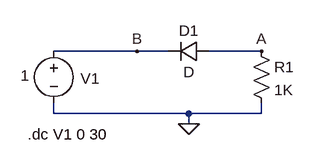
[diagram p0: schematic pn Junction Diode Reverse Biased.asc]
pn Junction Diode Reverse Biased.asc, the LTspice schematic file:
Version 4
SHEET 1 880 680
WIRE 96 96 -32 96
WIRE 144 96 96 96
WIRE 288 96 208 96
WIRE -32 192 -32 176
WIRE 176 192 -32 192
WIRE 288 192 288 176
WIRE 288 192 176 192
WIRE 176 208 176 192
FLAG 176 208 0
FLAG 288 96 A
FLAG 96 96 B
SYMBOL res 272 80 R0
SYMATTR InstName R1
SYMATTR Value 1K
SYMBOL voltage -32 80 R0
WINDOW 123 0 0 Left 0
WINDOW 39 0 0 Left 0
WINDOW 0 41 58 Left 2
WINDOW 3 -51 53 Left 2
SYMATTR InstName V1
SYMATTR Value 1
SYMBOL diode 208 80 R90
WINDOW 0 0 32 VBottom 2
WINDOW 3 32 32 VTop 2
SYMATTR InstName D1
TEXT -72 224 Left 2 !.dc V1 0 30

The netlist it stands for:
* pn Junction Diode Reverse Biased.asc
R1 A 0 1K
V1 B 0 1
D1 A B D
.model D D
.lib standard.dio
.dc V1 0 30
.backanno
.end